# EAGLE design qec_pcb_v4 (EAGLE 9.6.1)
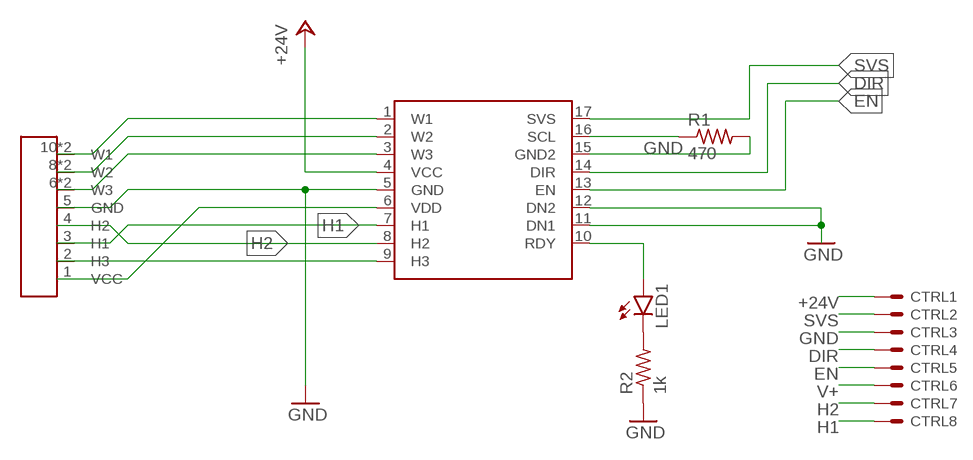
[diagram p0: schematic, sheet 1]

## Parts
CTRL  JST8  [JST]
DEC  1-Q-EC1-Q-EC-SMD  [1-Q-EC-SMD]
LED1  LEDCHIPLED_0805  [CHIPLED_0805]
MOTOR  68611114122  [68611114122]
R1  470  R-US_M0805  [M0805]
R2  1k  R-US_M0805  [M0805]

## Nets
+24V: CTRL.1 DEC.4(VCC)
DIR: CTRL.4 DEC.14(DIR)
EN: CTRL.5 DEC.13(EN)
GND: CTRL.3 DEC.5(GND) DEC.11(DN1) DEC.12(DN2) DEC.15(GND2) MOTOR.5(GND) R1.2 R2.1
H1: CTRL.8 DEC.7(H1) MOTOR.3(H1)
H2: CTRL.7 DEC.8(H2) MOTOR.4(H2)
H3: DEC.9(H3) MOTOR.2(H3)
N$1: LED1.C R2.2
N$2: DEC.10(RDY) LED1.A
N$5: DEC.1(W1) MOTOR.10(W1) MOTOR.11(W1)
N$6: DEC.16(SCL) R1.1
N$11: DEC.2(W2) MOTOR.8(W2) MOTOR.9(W2)
N$12: DEC.3(W3) MOTOR.6(W3) MOTOR.7(W3)
SVS: CTRL.2 DEC.17(SVS)
V+: CTRL.6 DEC.6(VDD) MOTOR.1(VCC)

## Library data of the parts
CTRL = dedo:JST8
DEC = dedo:1-Q-EC
LED1 = led:LED: LED OSRAM: - CHIPLED LG R971, LG N971, LY N971, LG Q971, LY Q971, LO R971, LY R971 LH N974, LH R974 LS Q976, LO Q976, LY Q976 LO Q996 - Hyper CHIPLED LW Q18S LB Q993, LB Q99A, LB R99A - SideLED LS A670, LO A670, LY A670, LG A670, LP A670 LB A673, LV A673, LT A673, LW A673 LH A674 LY A675 LS A676, LA A676, LO A676, LY A676, LW A676 LS A679, LY A679, LG A679 - Hyper Micro SIDELED® LS Y876, LA Y876, LO Y876, LY Y876 LT Y87S - SmartLED LW L88C, LW L88S LB L89C, LB L89S, LG L890 LS L89K, LO L89K, LY L89K LS L896, LA L896, LO L896, LY L896 - TOPLED LS T670, LO T670, LY T670, LG T670, LP T670 LSG T670, LSP T670, LSY T670, LOP T670, LYG T670 LG T671, LOG T671, LSG T671 LB T673, LV T673, LT T673, LW T673 LH T674 LS T676, LA T676, LO T676, LY T676, LB T676, LH T676, LSB T676, LW T676 LB T67C, LV T67C, LT T67C, LS T67K, LO T67K, LY T67K, LW E67C LS E67B, LA E67B, LO E67B, LY E67B, LB E67C, LV E67C, LT E67C LW T67C LS T679, LY T679, LG T679 LS T770, LO T770, LY T770, LG T770, LP T770 LB T773, LV T773, LT T773, LW T773 LH T774 LS E675, LA E675, LY E675, LS T675 LS T776, LA T776, LO T776, LY T776, LB T776 LHGB T686 LT T68C, LB T68C - Hyper Mini TOPLED® LB M676 - Mini TOPLED Santana® LG M470 LS M47K, LO M47K, LY M47K Source: http://www.osram.convergy.de LUXEON: - LUMILED® LXK2-PW12-R00, LXK2-PW12-S00, LXK2-PW14-U00, LXK2-PW14-V00 LXK2-PM12-R00, LXK2-PM12-S00, LXK2-PM14-U00 LXK2-PE12-Q00, LXK2-PE12-R00, LXK2-PE12-S00, LXK2-PE14-T00, LXK2-PE14-U00 LXK2-PB12-K00, LXK2-PB12-L00, LXK2-PB12-M00, LXK2-PB14-N00, LXK2-PB14-P00, LXK2-PB14-Q00 LXK2-PR12-L00, LXK2-PR12-M00, LXK2-PR14-Q00, LXK2-PR14-R00 LXK2-PD12-Q00, LXK2-PD12-R00, LXK2-PD12-S00 LXK2-PH12-R00, LXK2-PH12-S00 LXK2-PL12-P00, LXK2-PL12-Q00, LXK2-PL12-R00 Source: www.luxeon.com KINGBRIGHT: KA-3528ASYC Source: www.kingbright.com
MOTOR = dedo:68611114122: WR-FPC 1.00mm SMT ZIF Horizontal Top Contact, 11 Pins=>Code : Con_FPC_ZIF_1.00_68611114122 <http://katalog.we-online.de/media/images/eican/Con_FPC_ZIF_1.00_6861xx14122_pf2.jpg> Details see: http://katalog.we-online.de/en/em/686_1xx_141_22 Created 2014-07-09, Karrer Zheng 2014 (C) Würth Elektronik
R1 R2 = resistor:R-US_: RESISTOR, American symbol

## Board
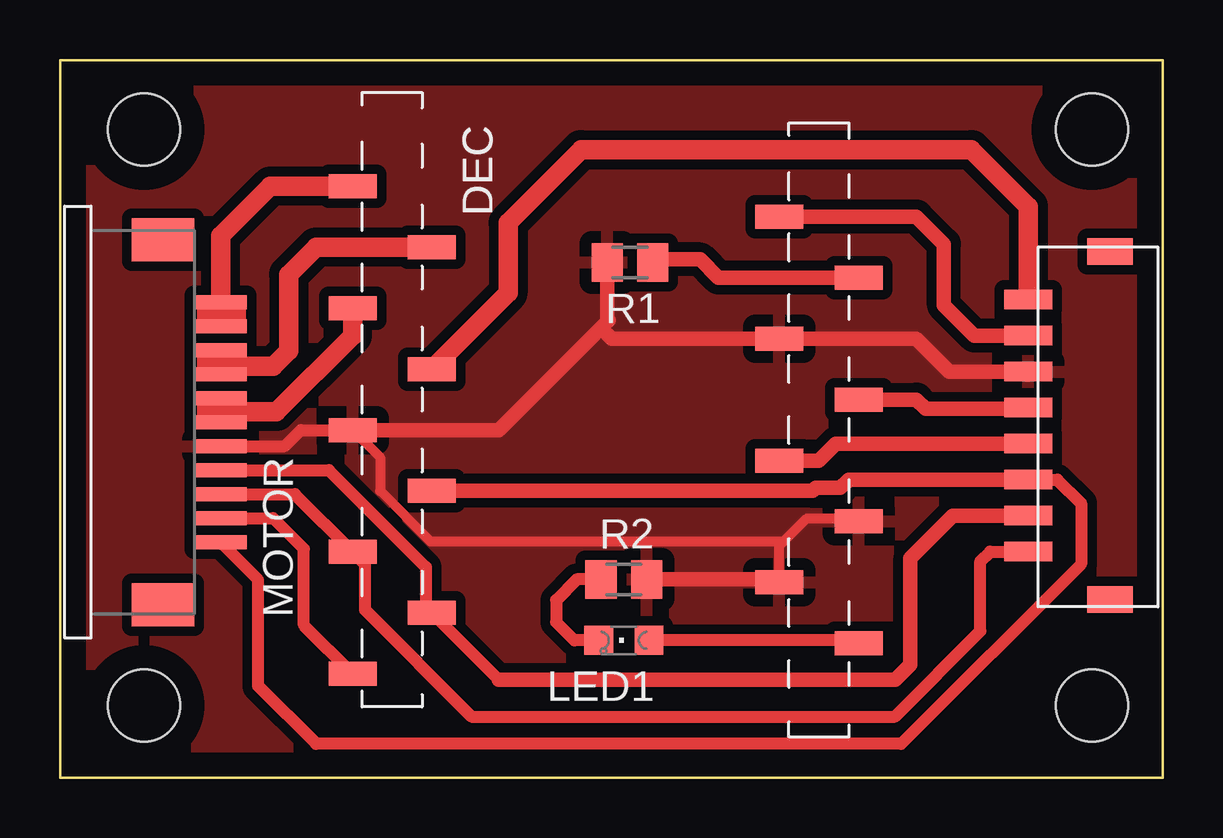
[diagram p1: board, top side]

Size 45.95 x 29.9 mm. Coordinates in mm from the lower left corner, seen from the top.
Outline: 0,0 45.95,0 45.95,29.9 0,29.9 0,0
Copper layers (1*16): Top 0.035mm / dielectric 1.5mm / Bottom 0.035mm
Design rules "default *": minimum track width 6mil, minimum drill 0.35mm, track to track 6mil, track to pad 6mil, pad to pad 6mil, via to via 6mil, smd to smd 6mil, copper to edge 40mil, drill to drill 6mil, minimum pad ring 10mil, minimum via ring 8mil, stop-mask expansion 4mil, vias tented up to drill 0mil, thermal gap 20mil
Holes 3 mm at 3.5,3 3.5,27 43,3 43,27

### Footprints (pad centres in the part's own frame; a part is rotated, then mirrored left to right if it is on the bottom)
JST = smd 0.8 x 2: 1 -4.8,-2.7; 2 -3.3,-2.7; 3 -1.8,-2.7; 4 -0.3,-2.7; 5 1.2,-2.7; 6 2.7,-2.7; 7 4.2,-2.7; 8 5.7,-2.7 | smd 1.1 x 1.9: 9 -6.8,0.7; 10 7.7,0.7
1-Q-EC-SMD = smd 2 x 1: 1 -10.54,7.62; 2 -7.24,5.08; 3 -10.54,2.54; 4 -7.24,0; 5 -10.54,-2.54; 6 -7.24,-5.08; 7 -10.54,-7.62; 8 -7.24,-10.16; 9 -10.54,-12.7; 10 10.54,-11.43; 11 7.24,-8.89; 12 10.54,-6.35; 13 7.24,-3.81; 14 10.54,-1.27; 15 7.24,1.27; 16 10.54,3.81; 17 7.24,6.35
CHIPLED_0805 = smd 1.2 x 1.2: A 0,-1.05; C 0,1.05
68611114122 = smd 0.6 x 2.2: 1 1.5,1.1; 2 0.5,1.1; 3 -0.5,1.1; 4 -1.5,1.1; 5 -2.5,1.1; 6 -3.5,1.1; 7 -4.5,1.1; 8 -5.5,1.1; 9 -6.5,1.1; 10 -7.5,1.1; 11 -8.5,1.1 | smd 1.8 x 2.6: Z1 -11.1,-1.3; Z2 4.1,-1.3
M0805 = smd 1.3 x 1.6: 1 -0.95,0; 2 0.95,0

### Placement (x,y rotation side)
CTRL  43.05,15.11 270 top
DEC  22.73,17.02 0 top
LED1  23.5,5.71 90 top
MOTOR  5.59,11.3 270 top
R1  23.75,21.46 180 top
R2  23.5,8.26 180 top

### Tracks (layer width: path | path; a pad name or v marks a point on that pad's centre or on a via)
+24V
  Top 0.813: CTRL.1 40.35,23.78 37.97,26.16 21.72,26.16 18.67,23.11 18.67,20.19 DEC.4
DIR
  Top 0.508: DEC.14 33.4,15.88
  Top 0.61: DEC.14 35.69,15.75 36.07,15.37 40.31,15.37 CTRL.4
EN
  Top 0.508: DEC.13 30.1,13.34
  Top 0.61: CTRL.5 32.33,13.91 31.62,13.21 DEC.13
GND
  Top 0.406: 33.27,10.92 33.27,10.79 31.11,10.79 30.16,9.84 | DEC.5 13.34,13.34 13.34,11.94 15.43,9.84 30.16,9.84 | DEC.11 29.97,9.65 30.16,9.84
  Top 0.508: 22.8,20.26 R1.2 | MOTOR.5 9.36,13.8 10.03,14.48 DEC.5 12.7,14.48 | 29.72,18.29 DEC.15
  Top 0.61: R1.2 22.8,19.11 22.86,19.05 22.54,18.73 | 22.54,18.73 18.29,14.48 12.7,14.48 | CTRL.3 37.06,16.91 35.69,18.29 DEC.15 22.99,18.29 22.54,18.73 | DEC.11 29.85,8.26 R2.1 | DEC.12 33.27,10.79
  Top 0.813: 40.33,16.89 CTRL.3 | 29.91,18.35 DEC.15 29.59,18.29
  pour Top (isolate 0.406): 0,0 45.97,0 45.97,29.84 0,29.84
H1
  Top 0.508: MOTOR.3 9.79,11.8 DEC.7 12.7,8.89 12.7,6.99 17.14,2.54 34.8,2.54 38.35,6.1 38.35,9.02 38.75,9.41 CTRL.8
H2
  Top 0.508: MOTOR.4 11.2,12.8 15.24,8.76 15.24,7.11 DEC.8 18.29,4.06
  Top 0.61: 18.29,4.06 34.8,4.06 35.43,4.7 35.43,9.14 37.2,10.91 CTRL.7
H3
  Top 0.508: MOTOR.2 8.88,10.8 10.16,9.53 10.16,6.35 DEC.9
N$1
  Top 0.508: LED1.C 21.43,5.71 20.67,6.48 20.67,7.39 21.53,8.26 R2.2
N$2
  Top 0.508: DEC.10 33.15,5.71 LED1.A
N$5
  Top 0.61: MOTOR.10 MOTOR.11
  Top 0.813: DEC.1 8.76,24.64 6.69,22.56 MOTOR.11
N$6
  Top 0.61: DEC.16 27.43,20.83 26.67,21.59 24.83,21.59 R1.1
N$11
  Top 0.61: MOTOR.9 6.69,17.14 MOTOR.8
  Top 0.813: DEC.2 10.67,22.1 9.53,20.95 9.53,17.78 8.89,17.14 6.69,17.14
N$12
  Top 0.61: MOTOR.7 MOTOR.6 7.12,15.24
  Top 0.813: DEC.3 12.19,18.41 9.02,15.24 7.12,15.24
SVS
  Top 0.61: CTRL.2 38.1,18.41 36.83,19.68 36.83,22.23 35.69,23.37 DEC.17
V+
  Top 0.508: MOTOR.1 8.26,8.24 8.26,3.81 10.67,1.4 35.05,1.4 42.55,8.89 42.55,11.43 41.56,12.41 CTRL.6
  Top 0.61: MOTOR.1 6.71,9.78 | CTRL.6 32.86,12.41 32.51,12.06 31.5,12.06 31.37,11.94 DEC.6
(copper drawn outside any net)
  shapes: Top area x3